# EAGLE design Converter (EAGLE 9.1.3)

## Sheet 1 of 3: Connectors & Caps
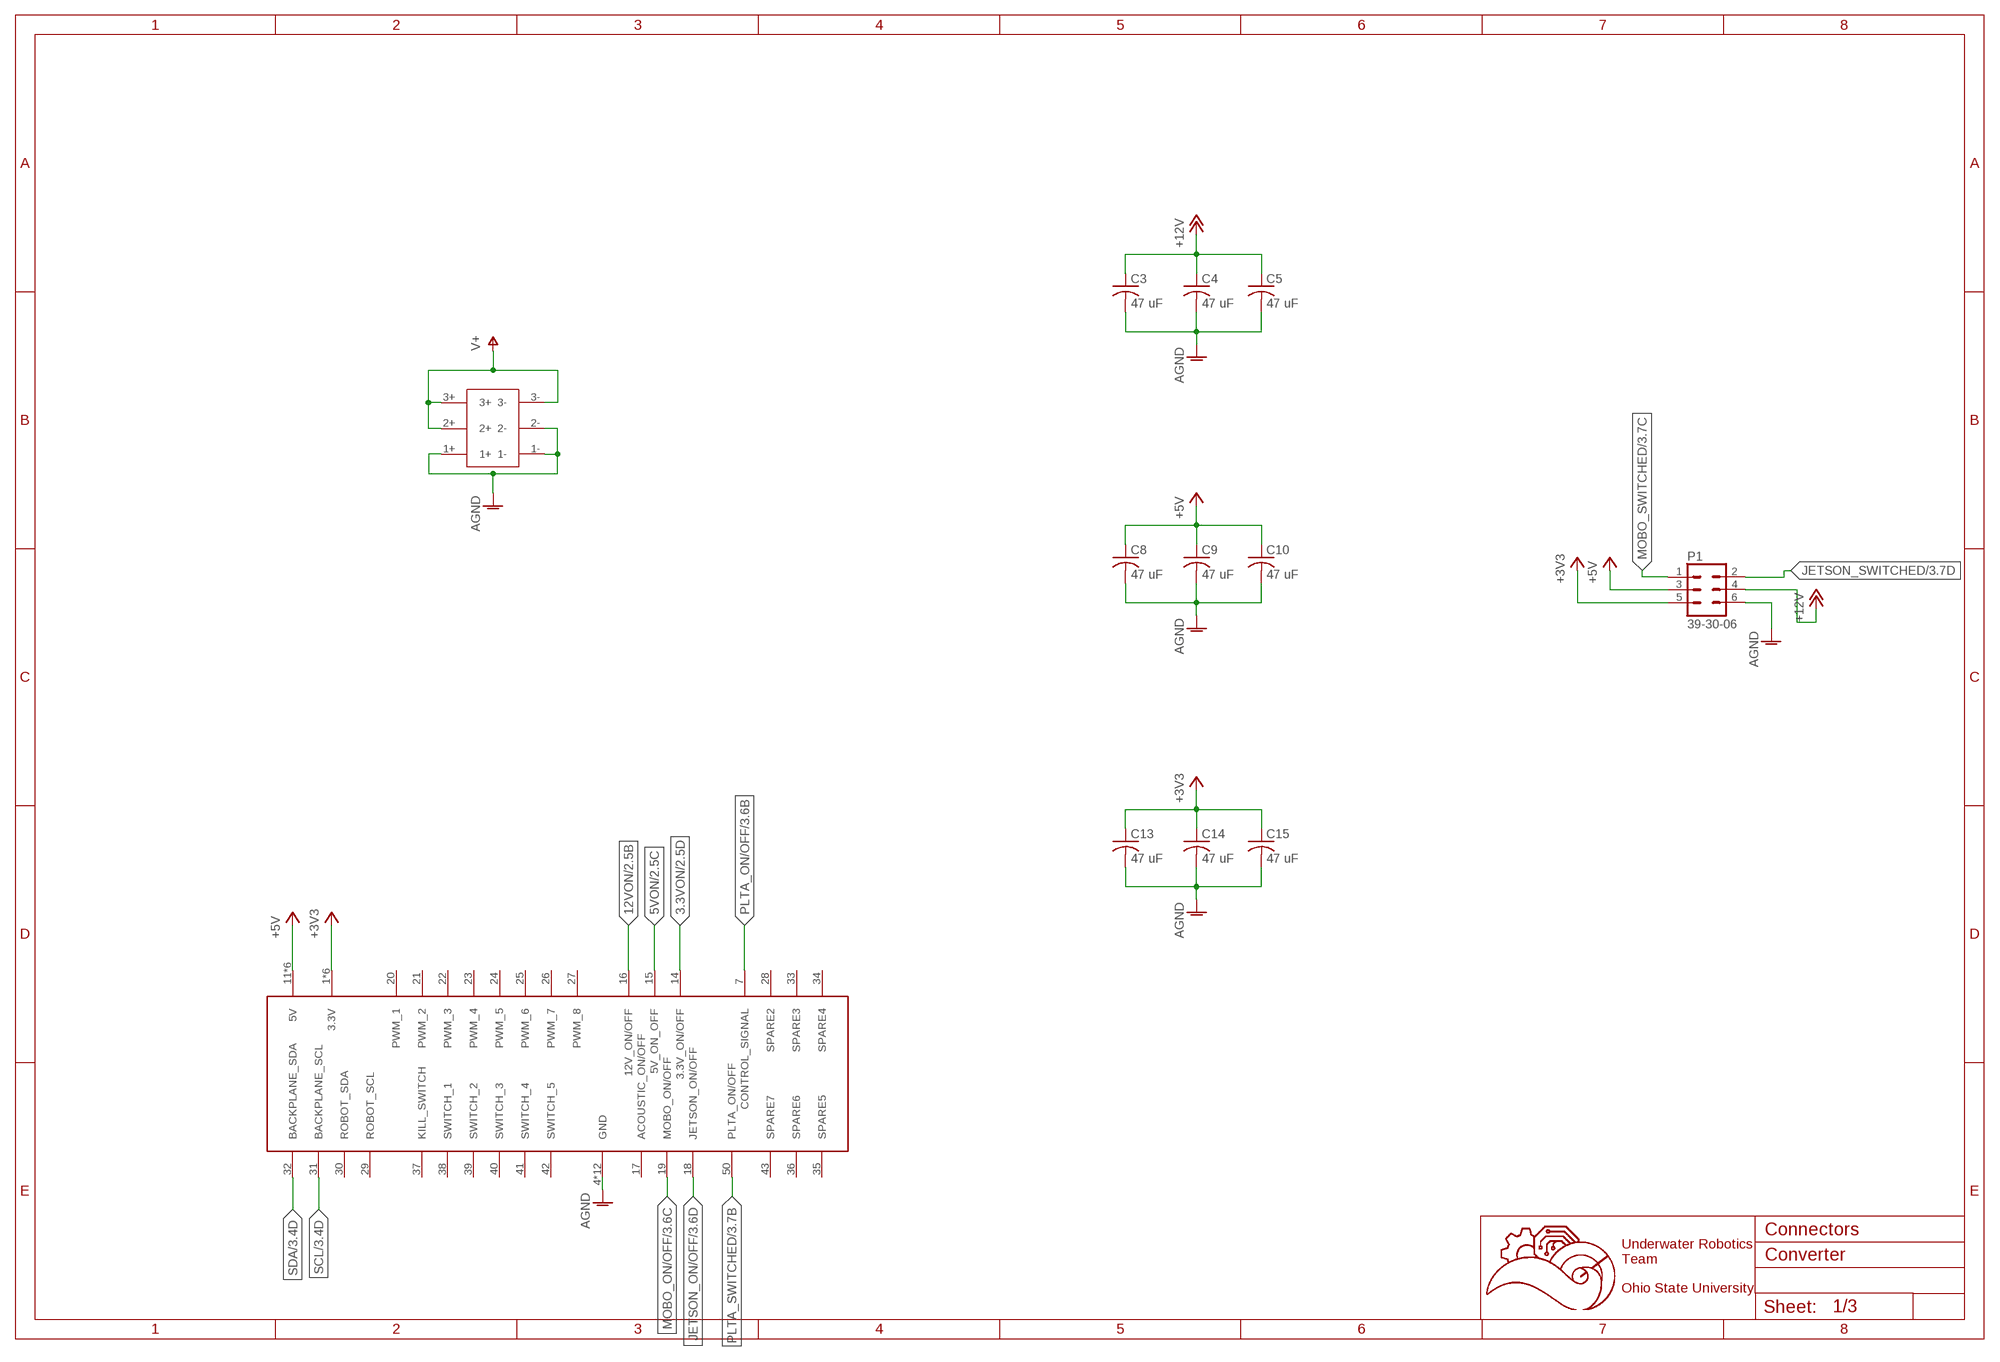
[diagram p0: schematic, sheet 1]

### Parts
C3  47 uF  C-USC1206K  [C1206K]
C4  47 uF  C-USC1206K  [C1206K]
C5  47 uF  C-USC1206K  [C1206K]
C8  47 uF  C-USC1206K  [C1206K]
C9  47 uF  C-USC1206K  [C1206K]
C10  47 uF  C-USC1206K  [C1206K]
C13  47 uF  C-USC1206K  [C1206K]
C14  47 uF  C-USC1206K  [C1206K]
C15  47 uF  C-USC1206K  [C1206K]
P1  39-30-06  [39-30-?06?]
U$1  5530843-EDGE  [5530843-6-BOARDFINGERS]
U$3  6PIN-VERT  [6PIN_VERT]

### Nets
3.3VON: U$1.14(3.3V_ON/OFF) ; also sheet 2
5VON: U$1.15(5V_ON_OFF) ; also sheet 2
12VON: U$1.16(12V_ON/OFF) ; also sheet 2
+3V3: C13.1 C14.1 C15.1 P1.5 U$1.1(3.3V) U$1.2(3.3V) U$1.3(3.3V) U$1.54(3.3V) U$1.55(3.3V) U$1.56(3.3V) ; also sheet 2,3
+5V: C8.1 C9.1 C10.1 P1.3 U$1.11(5V) U$1.12(5V) U$1.13(5V) U$1.44(5V) U$1.45(5V) U$1.46(5V) ; also sheet 2,3
+12V: C3.1 C4.1 C5.1 P1.4 ; also sheet 2,3
AGND: C3.2 C4.2 C5.2 C8.2 C9.2 C10.2 C13.2 C14.2 C15.2 P1.6 U$1.4(GND) U$1.5(GND) U$1.6(GND) U$1.8(GND) U$1.9(GND) U$1.10(GND) U$1.47(GND) U$1.48(GND) U$1.49(GND) U$1.51(GND) U$1.52(GND) U$1.53(GND) U$3.1+ U$3.1- U$3.2- ; also sheet 2,3
JETSON_ON/OFF: U$1.18(JETSON_ON/OFF) ; also sheet 3
JETSON_SWITCHED: P1.2 ; also sheet 3
MOBO_ON/OFF: U$1.19(MOBO_ON/OFF) ; also sheet 3
MOBO_SWITCHED: P1.1 ; also sheet 3
PLTA_ON/OFF: U$1.7(CONTROL_SIGNAL) ; also sheet 3
PLTA_SWITCHED: U$1.50(PLTA_ON/OFF) ; also sheet 3
SCL: U$1.31(BACKPLANE_SCL) ; also sheet 3
SDA: U$1.32(BACKPLANE_SDA) ; also sheet 3
V+: U$3.2+ U$3.3+ U$3.3- ; also sheet 2
Unconnected: U$1.17(ACOUSTIC_ON/OFF) U$1.20(PWM_1) U$1.21(PWM_2) U$1.22(PWM_3) U$1.23(PWM_4) U$1.24(PWM_5) U$1.25(PWM_6) U$1.26(PWM_7) U$1.27(PWM_8) U$1.28(SPARE2) U$1.29(ROBOT_SCL) U$1.30(ROBOT_SDA) U$1.33(SPARE3) U$1.34(SPARE4) U$1.35(SPARE5) U$1.36(SPARE6) U$1.37(KILL_SWITCH) U$1.38(SWITCH_1) U$1.39(SWITCH_2) U$1.40(SWITCH_3) U$1.41(SWITCH_4) U$1.42(SWITCH_5) U$1.43(SPARE7)

### Notes on the sheet
- Connectors
- Underwater Robotics
  Team
  
  Ohio State University

## Sheet 2 of 3: Converter
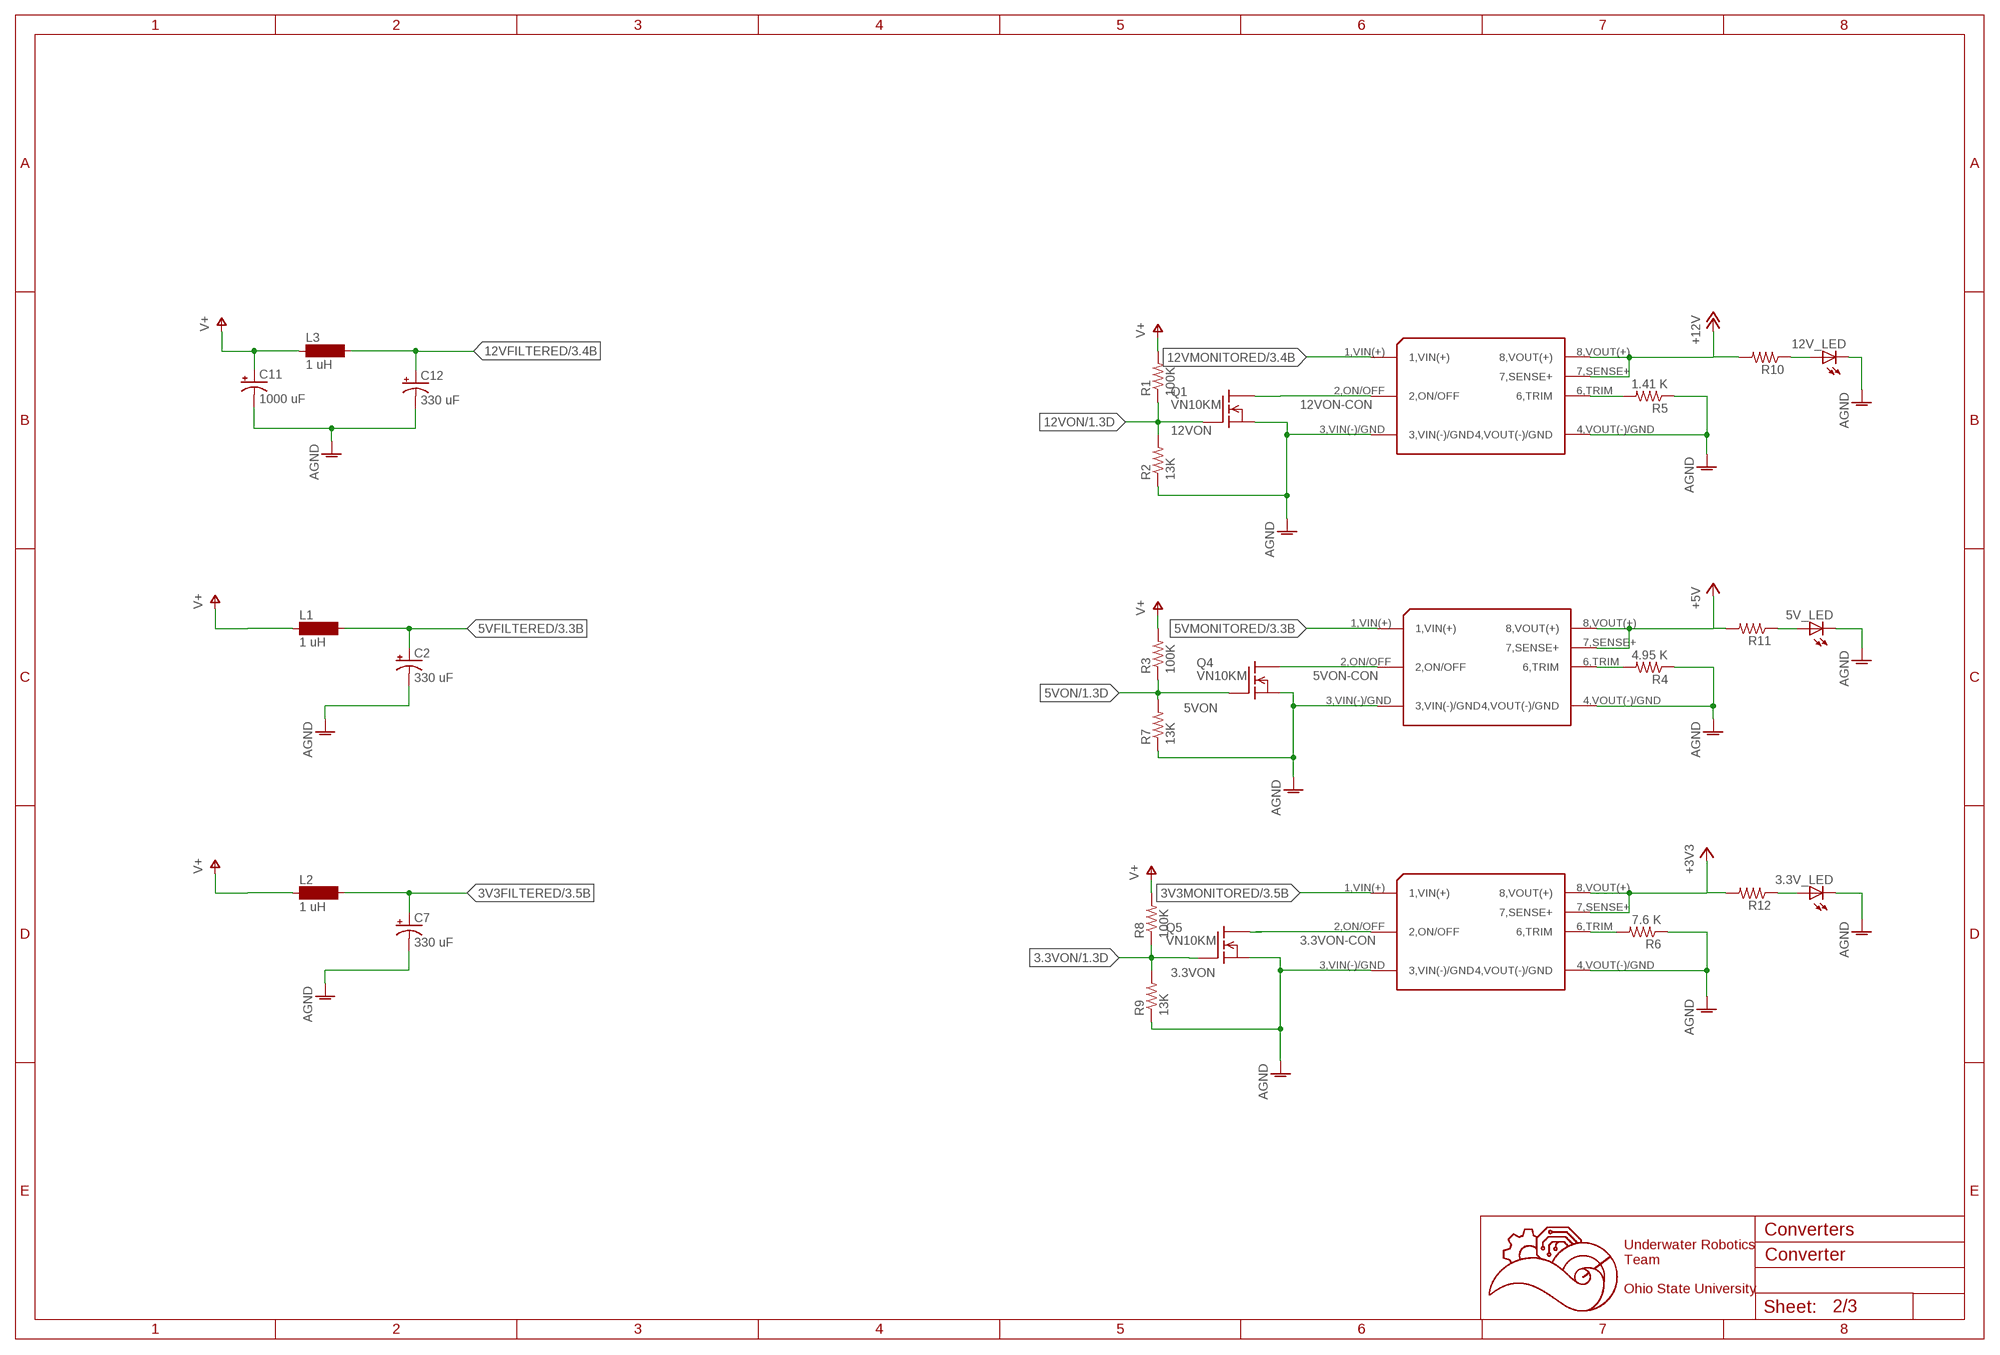
[diagram p1: schematic, sheet 2]

### Parts
3.3V_LED  LEDCHIPLED-0603-TTW  [CHIPLED-0603-TTW]
3.3VCONVERTER  CONVERTER  [CONVERTER]
5V_LED  LEDCHIPLED-0603-TTW  [CHIPLED-0603-TTW]
5VCONVERTER  CONVERTER  [CONVERTER]
12V_LED  LEDCHIPLED-0603-TTW  [CHIPLED-0603-TTW]
12VCONVERTER  CONVERTER  [CONVERTER]
C2  330 uF  CPOL-USE5-10.5  [E5-10,5]
C7  330 uF  CPOL-USE5-10.5  [E5-10,5]
C11  1000 uF  CPOL-USE5-13  [E5-13]
C12  330 uF  CPOL-USE5-10.5  [E5-10,5]
L1  1 uH  MS85  [MS85]
L2  1 uH  MS85  [MS85]
L3  1 uH  MS85  [MS85]
Q1  VN10KM  [TO237]
Q4  VN10KM  [TO237]
Q5  VN10KM  [TO237]
R1  100K  R-US_R0603  [R0603]
R2  13K  R-US_R0603  [R0603]
R3  100K  R-US_R0603  [R0603]
R4  4.95 K  R-US_R0603  [R0603]
R5  1.41 K  R-US_R0603  [R0603]
R6  7.6 K  R-US_R0603  [R0603]
R7  13K  R-US_R0603  [R0603]
R8  100K  R-US_R0603  [R0603]
R9  13K  R-US_R0603  [R0603]
R10  R-US_R0603  [R0603]
R11  R-US_R0603  [R0603]
R12  R-US_R0603  [R0603]

### Nets
3.3VON: Q5.2(G) R8.1 R9.2 ; also sheet 1
3.3VON-CON: 3.3VCONVERTER.2,ON/OFF Q5.1(D)
3V3FILTERED: C7.+ L2.2 ; also sheet 3
3V3MONITORED: 3.3VCONVERTER.1,VIN(+) ; also sheet 3
5VFILTERED: C2.+ L1.2 ; also sheet 3
5VMONITORED: 5VCONVERTER.1,VIN(+) ; also sheet 3
5VON: Q4.2(G) R3.1 R7.2 ; also sheet 1
5VON-CON: 5VCONVERTER.2,ON/OFF Q4.1(D)
12VFILTERED: C12.+ L3.2 ; also sheet 3
12VMONITORED: 12VCONVERTER.1,VIN(+) ; also sheet 3
12VON: Q1.2(G) R1.1 R2.2 ; also sheet 1
12VON-CON: 12VCONVERTER.2,ON/OFF Q1.1(D)
+3V3: 3.3VCONVERTER.7,SENSE+ 3.3VCONVERTER.8,VOUT(+) R12.2 ; also sheet 1,3
+5V: 5VCONVERTER.7,SENSE+ 5VCONVERTER.8,VOUT(+) R11.2 ; also sheet 1,3
+12V: 12VCONVERTER.7,SENSE+ 12VCONVERTER.8,VOUT(+) R10.2 ; also sheet 1,3
AGND: 3.3V_LED.C@1(C) 3.3VCONVERTER.3,VIN(-)/GND 3.3VCONVERTER.4,VOUT(-)/GND 5V_LED.C@1(C) 5VCONVERTER.3,VIN(-)/GND 5VCONVERTER.4,VOUT(-)/GND 12V_LED.C@1(C) 12VCONVERTER.3,VIN(-)/GND 12VCONVERTER.4,VOUT(-)/GND C2.- C7.- C11.- C12.- Q1.3(S) Q4.3(S) Q5.3(S) R2.1 R4.1 R5.1 R6.1 R7.1 R9.1 ; also sheet 1,3
N$1: 12VCONVERTER.6,TRIM R5.2
N$2: 5VCONVERTER.6,TRIM R4.2
N$3: 3.3VCONVERTER.6,TRIM R6.2
N$5: 12V_LED.A@1(A) R10.1
N$6: 5V_LED.A@1(A) R11.1
N$7: 3.3V_LED.A@1(A) R12.1
V+: C11.+ L1.1 L2.1 L3.1 R1.2 R3.2 R8.2 ; also sheet 1

### Notes on the sheet
- Converters
- Underwater Robotics
  Team
  
  Ohio State University
- C:/Users/blain/Downloads/Black and White.bmp

## Sheet 3 of 3
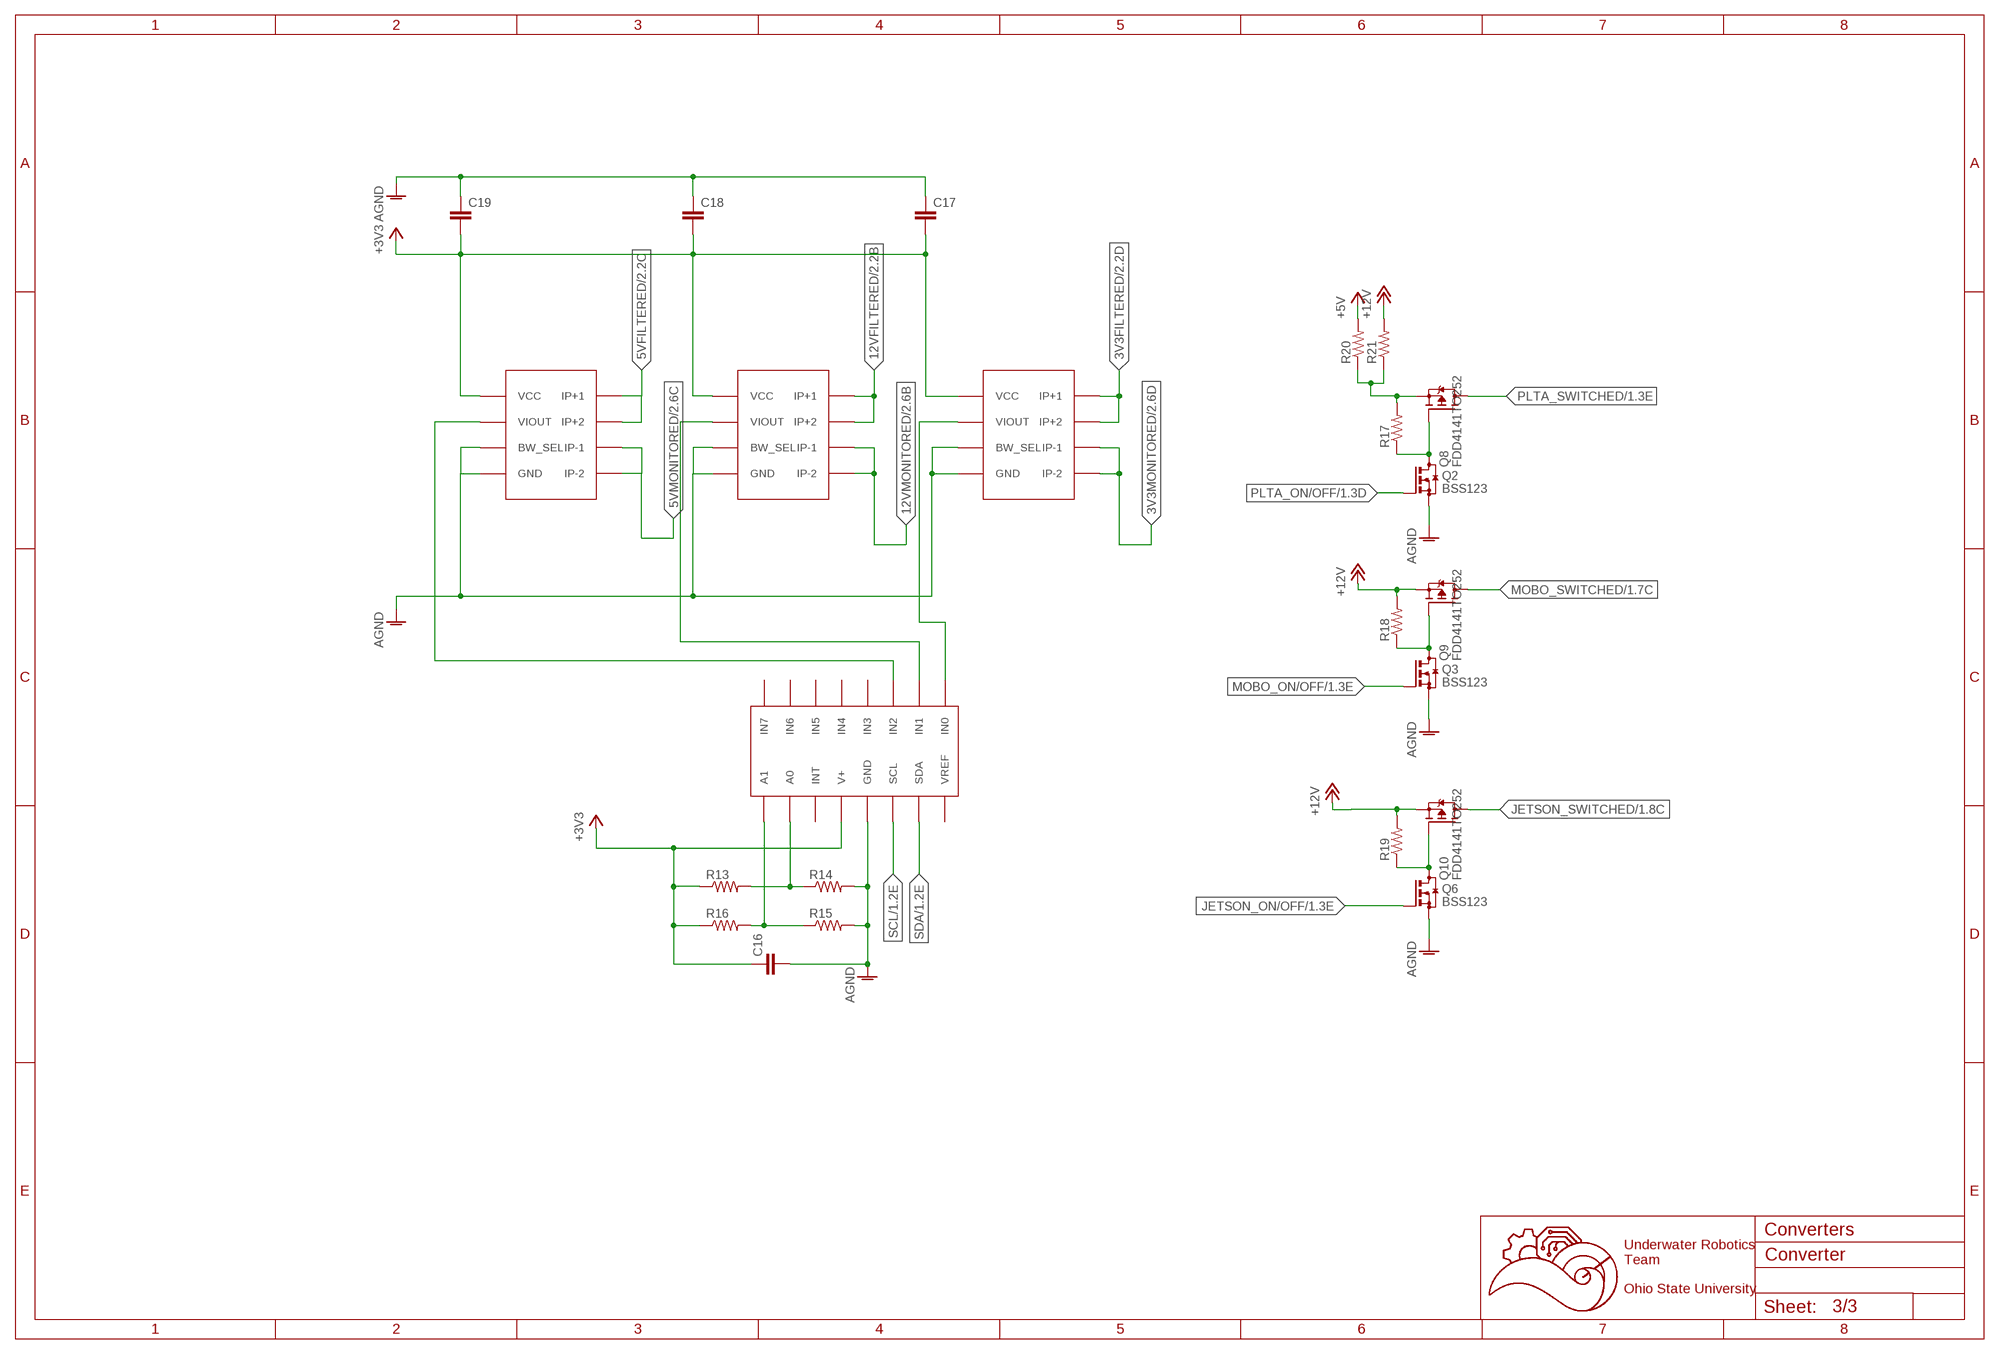
[diagram p2: schematic, sheet 3]

### Parts
1C  ACS722  [SOIC-8]
1C1  ACS722  [SOIC-8]
1C2  ACS722  [SOIC-8]
C16  C-EUC0603  [C0603]
C17  C-EUC0603  [C0603]
C18  C-EUC0603  [C0603]
C19  C-EUC0603  [C0603]
Q2  BSS123  [SOT23]
Q3  BSS123  [SOT23]
Q6  BSS123  [SOT23]
Q8  FDD4141TO252  [TO252]
Q9  FDD4141TO252  [TO252]
Q10  FDD4141TO252  [TO252]
R13  R-US_R0603  [R0603]
R14  R-US_R0603  [R0603]
R15  R-US_R0603  [R0603]
R16  R-US_R0603  [R0603]
R17  R-US_R0603  [R0603]
R18  R-US_R0603  [R0603]
R19  R-US_R0603  [R0603]
R20  R-US_R0603  [R0603]
R21  R-US_M2309  [M2309]
U$2  ADC128D818  [TSSOP-16]

### Nets
3V3FILTERED: 1C2.IP+1 1C2.IP+2 ; also sheet 2
3V3MONITORED: 1C2.IP-1 1C2.IP-2 ; also sheet 2
5VFILTERED: 1C.IP+1 1C.IP+2 ; also sheet 2
5VMONITORED: 1C.IP-1 1C.IP-2 ; also sheet 2
12VFILTERED: 1C1.IP+1 1C1.IP+2 ; also sheet 2
12VMONITORED: 1C1.IP-1 1C1.IP-2 ; also sheet 2
+3V3: 1C1.VCC 1C2.VCC 1C.VCC C16.1 C17.2 C18.2 C19.2 R13.1 R16.1 U$2.V+ ; also sheet 1,2
+5V: R20.2 ; also sheet 1,2
+12V: Q9.2(S) Q10.2(S) R18.2 R19.2 R21.2 ; also sheet 1,2
AGND: 1C1.BW_SEL 1C1.GND 1C2.BW_SEL 1C2.GND 1C.BW_SEL 1C.GND C16.2 C17.1 C18.1 C19.1 Q2.2(S) Q3.2(S) Q6.2(S) R14.2 R15.2 U$2.GND ; also sheet 1,2
JETSON_ON/OFF: Q6.1(G) ; also sheet 1
JETSON_SWITCHED: Q10.3(D) ; also sheet 1
MOBO_ON/OFF: Q3.1(G) ; also sheet 1
MOBO_SWITCHED: Q9.3(D) ; also sheet 1
N$8: Q2.3(D) Q8.1(G) R17.1
N$9: Q3.3(D) Q9.1(G) R18.1
N$10: Q8.2(S) R17.2 R20.1 R21.1
N$11: 1C.VIOUT U$2.IN2
N$12: 1C1.VIOUT U$2.IN1
N$13: 1C2.VIOUT U$2.IN0
N$14: Q6.3(D) Q10.1(G) R19.1
N$44: R13.2 R14.1 U$2.A0
N$46: R15.1 R16.2 U$2.A1
PLTA_ON/OFF: Q2.1(G) ; also sheet 1
PLTA_SWITCHED: Q8.3(D) ; also sheet 1
SCL: U$2.SCL ; also sheet 1
SDA: U$2.SDA ; also sheet 1
Unconnected: U$2.IN3 U$2.IN4 U$2.IN5 U$2.IN6 U$2.IN7 U$2.INT U$2.VREF

### Notes on the sheet
- Converters
- Underwater Robotics
  Team
  
  Ohio State University
- C:/Users/blain/Downloads/Black and White.bmp

## Library data of the parts
1C 1C1 1C2 = ACS722:ACS722
3.3V_LED 5V_LED 12V_LED = led:LED: LED OSRAM: - CHIPLED LG R971, LG N971, LY N971, LG Q971, LY Q971, LO R971, LY R971 LH N974, LH R974 LS Q976, LO Q976, LY Q976 LO Q996 - Hyper CHIPLED LW Q18S LB Q993, LB Q99A, LB R99A - SideLED LS A670, LO A670, LY A670, LG A670, LP A670 LB A673, LV A673, LT A673, LW A673 LH A674 LY A675 LS A676, LA A676, LO A676, LY A676, LW A676 LS A679, LY A679, LG A679 - Hyper Micro SIDELED® LS Y876, LA Y876, LO Y876, LY Y876 LT Y87S - SmartLED LW L88C, LW L88S LB L89C, LB L89S, LG L890 LS L89K, LO L89K, LY L89K LS L896, LA L896, LO L896, LY L896 - TOPLED LS T670, LO T670, LY T670, LG T670, LP T670 LSG T670, LSP T670, LSY T670, LOP T670, LYG T670 LG T671, LOG T671, LSG T671 LB T673, LV T673, LT T673, LW T673 LH T674 LS T676, LA T676, LO T676, LY T676, LB T676, LH T676, LSB T676, LW T676 LB T67C, LV T67C, LT T67C, LS T67K, LO T67K, LY T67K, LW E67C LS E67B, LA E67B, LO E67B, LY E67B, LB E67C, LV E67C, LT E67C LW T67C LS T679, LY T679, LG T679 LS T770, LO T770, LY T770, LG T770, LP T770 LB T773, LV T773, LT T773, LW T773 LH T774 LS E675, LA E675, LY E675, LS T675 LS T776, LA T776, LO T776, LY T776, LB T776 LHGB T686 LT T68C, LB T68C - Hyper Mini TOPLED® LB M676 - Mini TOPLED Santana® LG M470 LS M47K, LO M47K, LY M47K Source: http://www.osram.convergy.de LUXEON: - LUMILED® LXK2-PW12-R00, LXK2-PW12-S00, LXK2-PW14-U00, LXK2-PW14-V00 LXK2-PM12-R00, LXK2-PM12-S00, LXK2-PM14-U00 LXK2-PE12-Q00, LXK2-PE12-R00, LXK2-PE12-S00, LXK2-PE14-T00, LXK2-PE14-U00 LXK2-PB12-K00, LXK2-PB12-L00, LXK2-PB12-M00, LXK2-PB14-N00, LXK2-PB14-P00, LXK2-PB14-Q00 LXK2-PR12-L00, LXK2-PR12-M00, LXK2-PR14-Q00, LXK2-PR14-R00 LXK2-PD12-Q00, LXK2-PD12-R00, LXK2-PD12-S00 LXK2-PH12-R00, LXK2-PH12-S00 LXK2-PL12-P00, LXK2-PL12-Q00, LXK2-PL12-R00 Source: www.luxeon.com KINGBRIGHT: KA-3528ASYC Source: www.kingbright.com
3.3VCONVERTER 5VCONVERTER 12VCONVERTER = converter:CONVERTER
C2 C7 C11 C12 = rcl:CPOL-US: POLARIZED CAPACITOR, American symbol; SPICEPREFIX: C
C3-C5 C8-C10 C13-C15 = resistor:C-US: CAPACITOR, American symbol
C16-C19 = rcl:C-EU: CAPACITOR, European symbol; SPICEPREFIX: C
L1-L3 = inductor-neosid:MS85: INDUCTOR SMD power inductor; OC_FARNELL: unknown; OC_NEWARK: unknown
P1 = con-molex-mini-fit:39-30-?06?: HEADER
Q1 Q4 Q5 = transistor-fet:VN10KM: N-Channel Enhancement MOSFET (VMOS); 60V; 0,5A; 5,0Ohm
Q2 Q3 Q6 = transistor-small-signal:BSS123: N-CHANNEL MOS FET
Q8-Q10 = transistor-fet:FDD4141: P-Channel PowerTrench® MOSFET Source: FDD4141.pdf
R1-R12 = rcl:R-US_: RESISTOR, American symbol; SPICEPREFIX: R
R13-R21 = resistor:R-US_: RESISTOR, American symbol
U$1 = 5530843-6:5530843-EDGE
U$2 = ADC128D818:ADC128D818
U$3 = Vertical_Connectors:6PIN-VERT

## Board
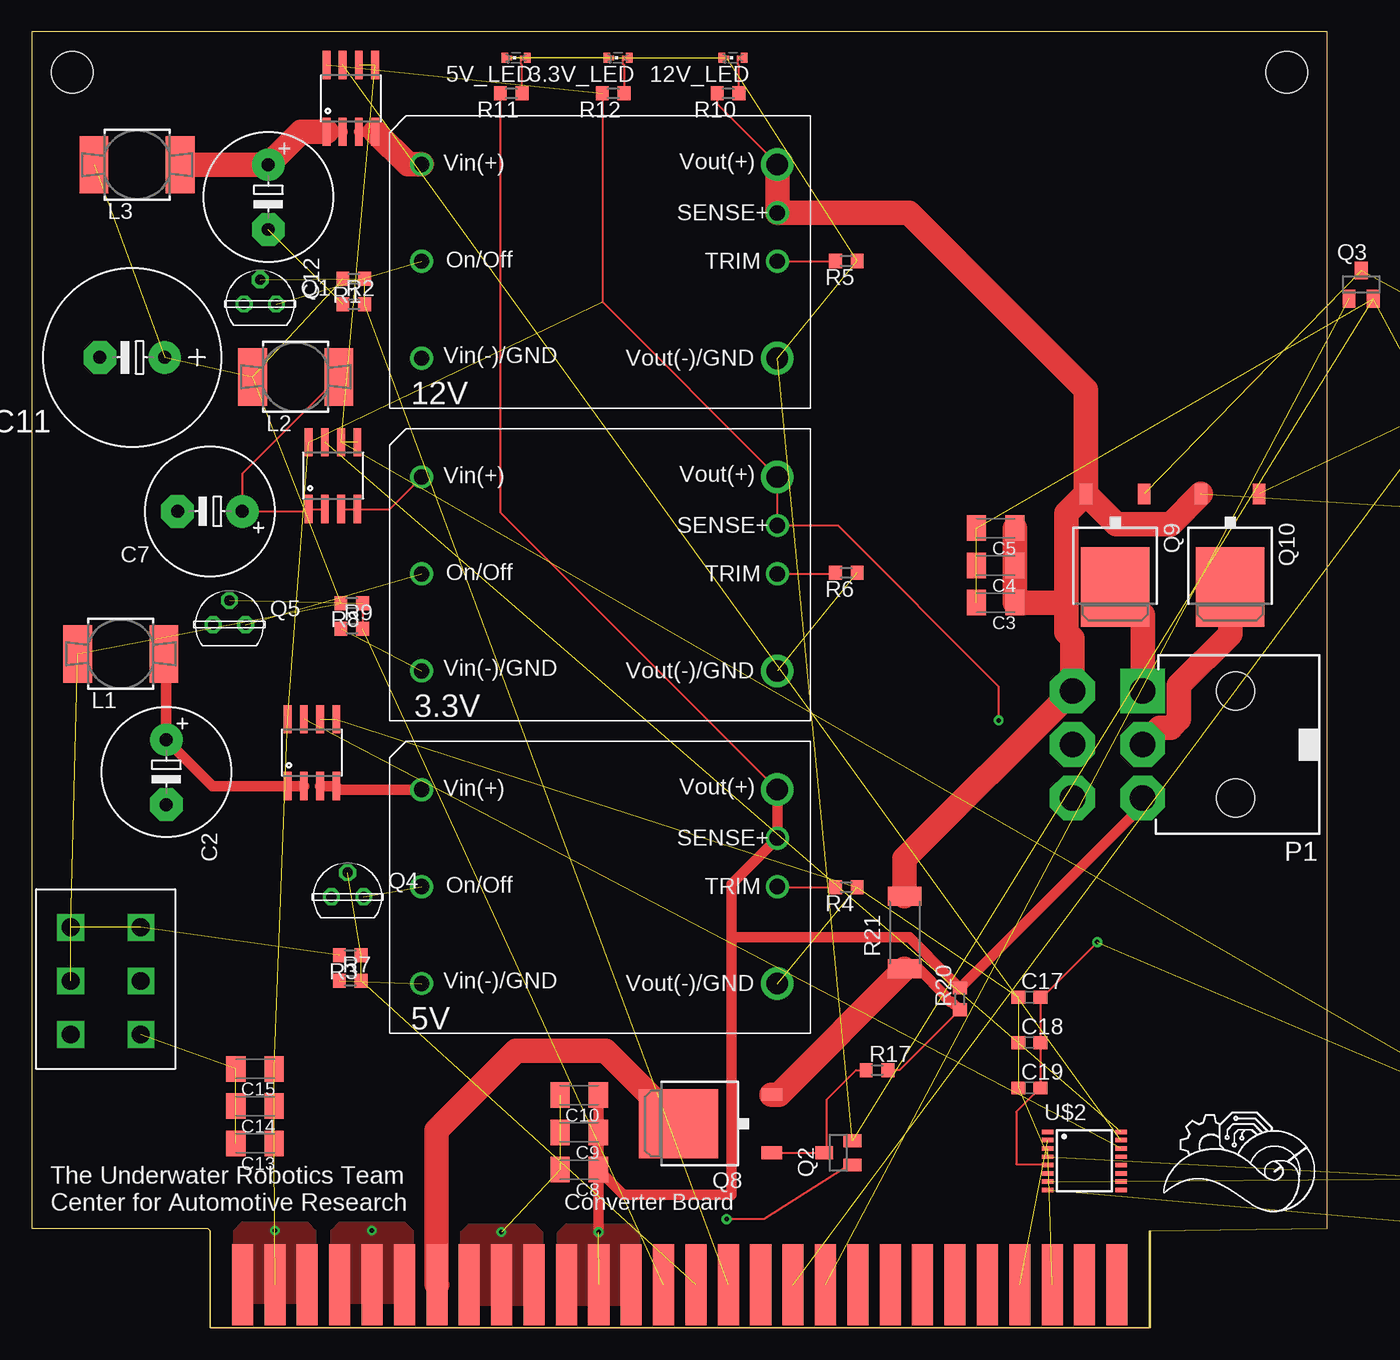
[diagram p3: board, top side]
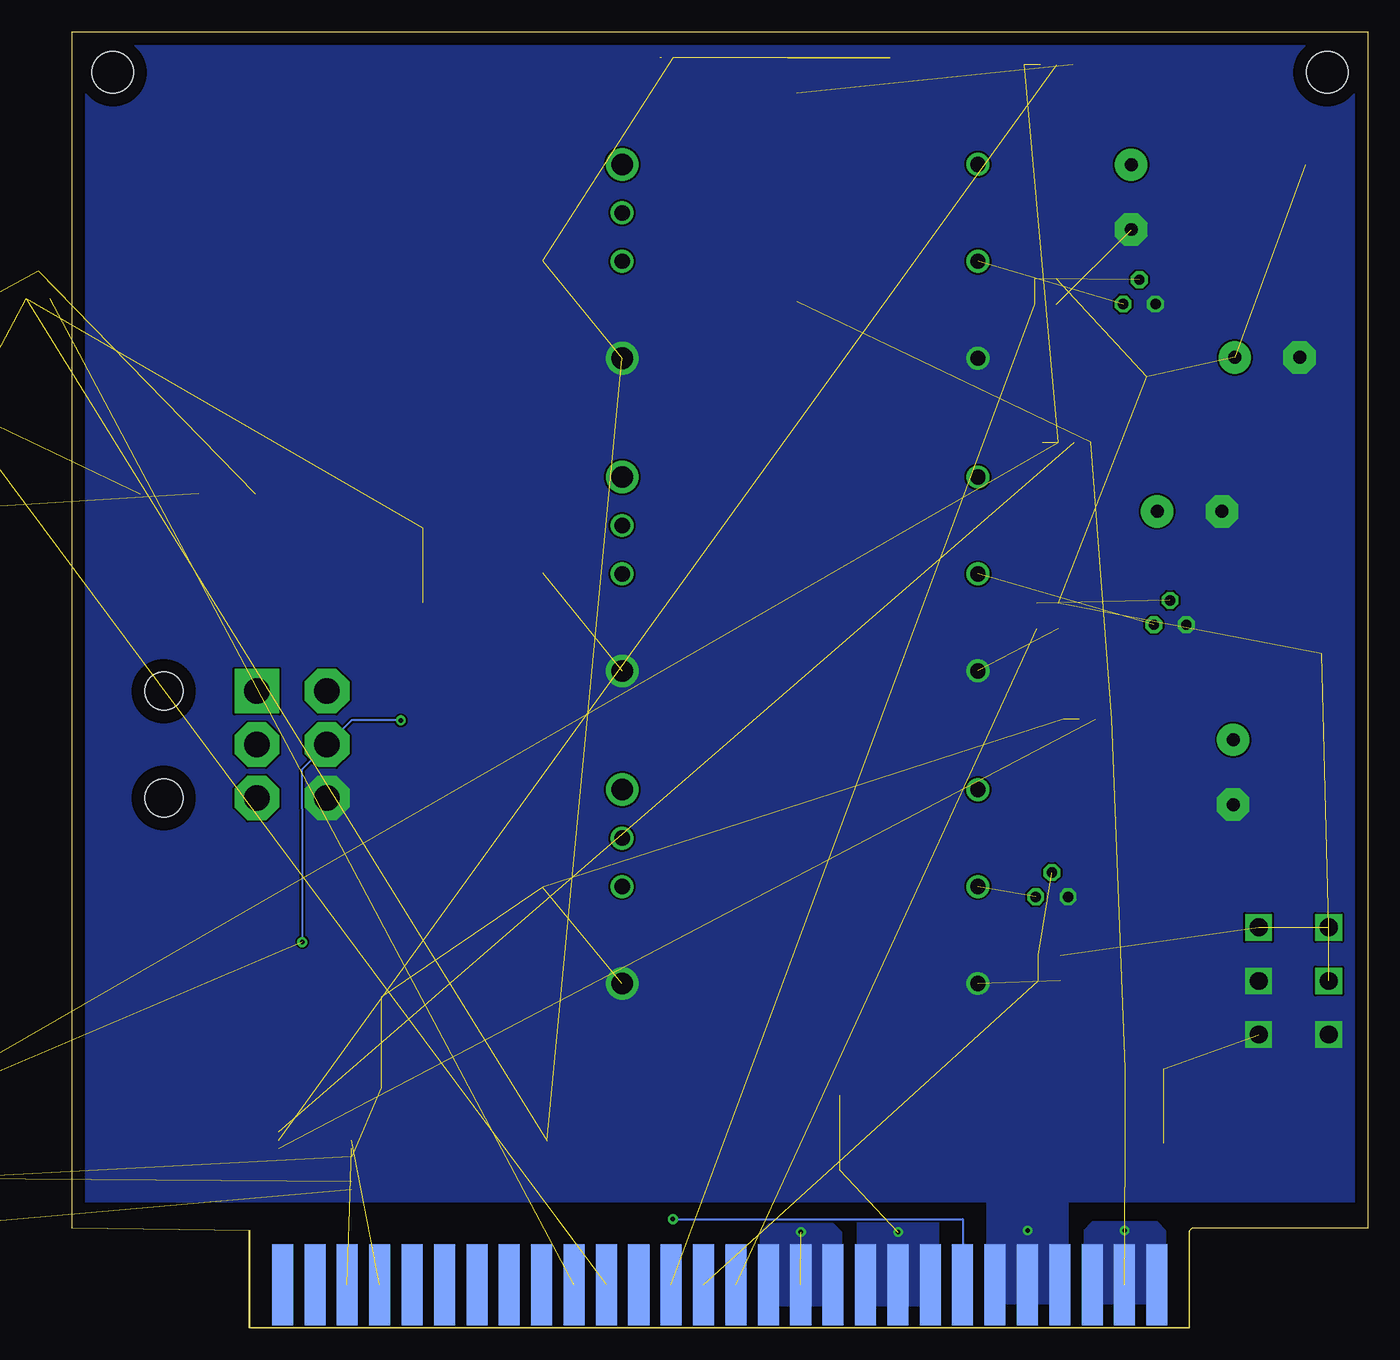
[diagram p4: board, bottom side, seen from below]

Size 101.6 x 101.6 mm. Coordinates in mm from the lower left corner, seen from the top.
Outline: 0,7.8 13.79,7.8 13.97,7.62 13.97,0 87.63,0 87.63,7.62 101.6,7.8 101.6,101.6 0,101.6 0,7.8
Copper layers (1*16): Top 0.035mm / dielectric 1.5mm / Bottom 0.035mm
Design rules "default": minimum track width 6mil, minimum drill 0.35mm, track to track 6mil, track to pad 6mil, pad to pad 6mil, via to via 6mil, smd to smd 6mil, copper to edge 40mil, drill to drill 6mil, minimum pad ring 10mil, minimum via ring 8mil, stop-mask expansion 4mil, vias tented up to drill 0mil, thermal gap 10mil
Holes 3.26 mm at 3.17,98.42 98.42,98.42

### Footprints (pad centres in the part's own frame; a part is rotated, then mirrored left to right if it is on the bottom)
SOIC-8 = smd 0.61 x 2.21: BW_SEL 0.635,2.616; GND 1.905,2.616; IP+1 -1.905,-2.616; IP+2 -0.635,-2.616; IP-1 0.635,-2.616; IP-2 1.905,-2.616; VCC -1.905,2.616; VIOUT -0.635,2.616
CHIPLED-0603-TTW = smd 0.8 x 0.5: A 0,-0.875; C 0,0.875 | smd 0.35 x 0.35: A@1 0,-0.5; C@1 0,0.5
CONVERTER = drill 1.2: 1,VIN(+) 2.5,19.1; 2,ON/OFF 2.5,11.5; 3,VIN(-)/GND 2.5,3.9; 6,TRIM 30.4,11.5; 7,SENSE+ 30.4,15.3 | drill 1.7: 4,VOUT(-)/GND 30.4,3.9; 8,VOUT(+) 30.4,19.1
E5-10,5 = drill 1.016 pad 2.54: + -2.54,0 | drill 1.016 pad 2.54 octagon: - 2.54,0
C1206K = smd 1.5 x 2: 1 -1.5,0; 2 1.5,0
E5-13 = drill 1.016 pad 2.54: + -2.54,0 | drill 1.016 pad 2.54 octagon: - 2.54,0
C0603 = smd 1.1 x 1: 1 -0.85,0; 2 0.85,0
MS85 = smd 4.5 x 2.25: 1 0,-3.383; 2 0,3.383
39-30-?06? = drill 2 pad 3.5 square: 1 4.191,0 | drill 2 pad 3.5 octagon: 2 0,0; 3 -4.191,0; 4 4.191,5.512; 5 0,5.512; 6 -4.191,5.512 | hole 3: -4.191,-7.3; 4.191,-7.3
TO237 = drill 0.813 octagon: 1 1.27,0; 2 0,1.905; 3 -1.27,0
SOT23 = smd 1 x 1.4: 1 -0.95,-1.1; 2 0.95,-1.1; 3 0,1.1
TO252 = smd 1 x 1.6: 1 -2.28,-4.8; 2 2.28,-4.8 | smd 5.4 x 6.2: 3 0,2.5
R0603 = smd 1 x 1.1: 1 -0.85,0; 2 0.85,0
M2309 = smd 1.5 x 2.6: 1 -2.85,0; 2 2.85,0
5530843-6-BOARDFINGERS = smd 1.651 x 6.35 bottom: 1 0.826,3.375; 2 3.365,3.375; 3 5.905,3.375; 4 8.445,3.375; 5 10.986,3.375; 6 13.525,3.375; 7 16.066,3.375; 8 18.605,3.375; 9 21.145,3.375; 10 23.686,3.375; 11 26.226,3.375; 12 28.765,3.375; 13 31.305,3.375; 14 33.846,3.375; 15 36.386,3.375; 16 38.925,3.375; 17 41.465,3.375; 18 44.005,3.375; 19 46.545,3.375; 20 49.086,3.375; 21 51.626,3.375; 22 54.166,3.375; 23 56.706,3.375; 24 59.245,3.375; 25 61.785,3.375; 26 64.326,3.375; 27 66.865,3.375; 28 69.406,3.375 | smd 1.651 x 6.35: 29 69.406,3.375; 30 66.865,3.375; 31 64.326,3.375; 32 61.785,3.375; 33 59.245,3.375; 34 56.706,3.375; 35 54.166,3.375; 36 51.626,3.375; 37 49.086,3.375; 38 46.545,3.375; 39 44.005,3.375; 40 41.465,3.375; 41 38.925,3.375; 42 36.386,3.375; 43 33.846,3.375; 44 31.305,3.375; 45 28.765,3.375; 46 26.226,3.375; 47 23.686,3.375; 48 21.145,3.375; 49 18.605,3.375; 50 16.066,3.375; 51 13.525,3.375; 52 10.986,3.375; 53 8.445,3.375; 54 5.905,3.375; 55 3.365,3.375; 56 0.826,3.375
TSSOP-16 = smd 0.9 x 0.35: A0 -2.875,-1.625; A1 -2.875,-2.275; GND -2.875,0.325; IN0 2.875,2.275; IN1 2.875,1.625; IN2 2.875,0.975; IN3 2.875,0.325; IN4 2.875,-0.325; IN5 2.875,-0.975; IN6 2.875,-1.625; IN7 2.875,-2.275; INT -2.875,-0.975; SCL -2.875,0.975; SDA -2.875,1.625; V+ -2.875,-0.325; VREF -2.875,2.275
6PIN_VERT = drill 1.4 square: 1+ 0,0; 1- 5.5,0; 2+ 0,4.2; 2- 5.5,4.2; 3+ 0,8.4; 3- 5.5,8.4

### Placement (x,y rotation side)
1C  21.97,45.09 0 top
1C1  25.02,96.39 0 top
1C2  23.62,66.8 0 top
3.3V_LED  45.97,99.57 90 top
3.3VCONVERTER  28.07,47.6 0 top
5V_LED  37.97,99.57 90 top
5VCONVERTER  28.07,23.09 0 top
12V_LED  54.99,99.57 90 top
12VCONVERTER  28.07,72.11 0 top
C2  10.54,43.56 270 top
C3  75.59,56.85 180 top
C4  75.59,59.77 180 top
C5  75.59,62.69 180 top
C7  13.97,64.01 180 top
C8  42.93,12.4 180 top
C9  42.93,15.32 180 top
C10  42.93,18.24 180 top
C11  7.87,76.07 180 top
C12  18.54,88.65 270 top
C13  17.5,14.45 180 top
C14  17.5,17.37 180 top
C15  17.5,20.29 180 top
C16  111.25,18.8 0 top  (outside the outline)
C17  78.23,25.91 0 top
C18  78.23,22.35 0 top
C19  78.23,18.8 0 top
L1  6.99,52.83 270 top
L2  20.7,74.55 270 top
L3  8.26,91.19 270 top
P1  39-30-06?  [39-30-?06?]  87.12,45.72 90 top
Q1  17.91,80.26 0 top
Q2  63.25,13.72 90 top
Q3  104.27,81.79 0 top
Q4  24.77,33.78 0 top
Q5  15.49,55.12 0 top
Q6  110.11,70.87 0 top  (outside the outline)
Q8  53.21,16 90 top
Q9  84.96,60.58 180 top
Q10  93.98,60.58 180 top
R1  25.25,82.25 180 top
R2  25.25,80.24 0 top
R3  24.97,29.21 180 top
R4  63.88,34.54 180 top
R5  63.88,83.64 180 top
R6  63.88,59.18 180 top
R7  24.97,27.2 0 top
R8  25.1,56.82 180 top
R9  25.1,54.81 0 top
R10  54.61,96.77 180 top
R11  37.59,96.77 180 top
R12  45.59,96.77 180 top
R13  111.25,15.24 0 top  (outside the outline)
R14  111.25,11.68 0 top  (outside the outline)
R15  111.25,8.13 0 top  (outside the outline)
R16  111.25,4.57 0 top  (outside the outline)
R17  66.29,20.19 0 top
R18  143.26,62.1 0 top  (outside the outline)
R19  152.27,62.1 0 top  (outside the outline)
R20  72.77,25.78 90 top
R21  68.45,30.99 90 top
U$1  15.7,0 0 top
U$2  82.55,13.08 0 top
U$3  3.05,22.99 0 top

### Tracks (layer width: path | path; a pad name or v marks a point on that pad's centre or on a via)
3.3VON  (2 unrouted)
  Top 0.152: R8.1 R9.2 25.95,54.79
  Bottom 0.152: 49.66,3.29 U$1.14
3.3VON-CON  (1 unrouted)
3V3FILTERED
  Top 0.152: L2.2 16.51,66.97 C7.+ 21.54,64.01 1C2.IP+1 1C2.IP+2
3V3MONITORED
  Top 0.152: 1C2.IP-1 1C2.IP-2 28.05,64.19 3.3VCONVERTER.1,VIN(+)
5VFILTERED
  Top 0.813: L1.2 10.54,52.66 C2.+ 14.17,42.47 1C.IP+1 1C.IP+2
5VMONITORED
  Top 0.813: 1C.IP-1 1C.IP-2 24.16,42.19 5VCONVERTER.1,VIN(+)
5VON  (3 unrouted)
  Top 0.152: 25.83,27.23 R7.2
5VON-CON  (1 unrouted)
12VFILTERED
  Top 0.813: 1C1.IP+2 1C1.IP+1
  Top 1.905: L3.2 C12.+ 21.13,93.78 1C1.IP+1
12VMONITORED
  Top 0.813: 1C1.IP-1 1C1.IP-2
  Top 1.905: 1C1.IP-2 29.49,91.21 12VCONVERTER.1,VIN(+)
12VON  (3 unrouted)
  Top 0.152: 26.11,82.25 R1.1 | R2.2
12VON-CON  (1 unrouted)
+3V3  (via drill 0.35)  (11 unrouted)
  Top 0.152: R12.2 44.74,80.42 3.3VCONVERTER.8,VOUT(+) 3.3VCONVERTER.7,SENSE+ 63.21,62.9 75.82,50.29 v75.82,47.62 | v83.57,30.23 79.25,25.91 C17.2 C18.2 C19.2 77.22,16.93 77.22,12.83 79.6,12.83 U$2.V+
  Bottom 0.152: v75.82,47.62 79.7,47.62 P1.5 83.59,43.74 83.59,40.71 83.57,40.69 v83.57,30.23
  other vias: 19.05,7.62
  pour Top (no thermals): 15.88,7.62 16.51,8.26 21.59,8.26 22.23,7.62 22.23,1.91 15.88,1.91
  pour Bottom (no thermals): 15.88,7.62 16.51,8.26 21.59,8.26 22.23,7.62 22.23,1.91 15.88,1.91
+5V  (via drill 0.35)  (1 unrouted)
  Top 0.152: 5VCONVERTER.8,VOUT(+) 36.74,63.91 R11.2
  Top 0.813: 5VCONVERTER.8,VOUT(+) 5VCONVERTER.7,SENSE+ 54.86,34.79 54.86,30.61 | 54.86,30.61 54.86,10.41 46.41,10.41 C8.1 | C10.1 C9.1 C8.1 | C8.1 44.43,7.52 v44.45,7.49 | 54.86,30.61 68.82,30.61 70.31,29.12 70.31,29.09 R20.2 87.12,40.98 P1.3
  pour Bottom (no thermals): 41.27,7.49 41.91,8.13 46.99,8.13 47.62,7.49 47.62,1.78 41.27,1.78
  pour Top (no thermals): 41.27,7.49 41.91,8.13 46.99,8.13 47.62,7.49 47.62,1.78 41.27,1.78
+12V  (2 unrouted)
  Top 0.152: 12VCONVERTER.8,VOUT(+) 53.76,95.92 R10.2
  Top 1.905: 81.16,57.15 81.16,54.52 81.61,54.07 P1.4 68.45,36.75 R21.2 | 81.16,57.15 81.16,63.85 Q9.2 | Q9.2 85.07,62.99 89.31,62.99 Q10.2 | 12VCONVERTER.8,VOUT(+) 12VCONVERTER.7,SENSE+ 68.8,87.41 82.68,73.53 Q9.2 | 81.16,57.15 80.85,56.84 C3.1 C4.1 C5.1
AGND  (via drill 0.35)  (34 unrouted)
  other vias: 26.67,7.62 36.83,7.49
  pour Bottom (no thermals): 102.87,103.35 102.87,9.91 -1.02,9.91 -1.02,102.62 -1.02,102.87 0,102.87
  pour Bottom: 23.5,7.62 23.5,10.54 29.84,10.54 29.84,7.24 23.5,7.24
  pour Bottom (no thermals): 23.5,7.62 24.13,8.26 29.21,8.26 29.84,7.62 29.84,1.91 23.5,1.91
  pour Top (no thermals): 23.5,7.62 24.13,8.26 29.21,8.26 29.84,7.62 29.84,1.91 23.5,1.91
  pour Bottom: 33.66,7.49 33.66,10.41 40.01,10.41 40.01,7.11 33.66,7.11
  pour Bottom (no thermals): 33.66,7.49 34.29,8.13 39.37,8.13 40.01,7.49 40.01,1.78 33.66,1.78
  pour Top (no thermals): 33.66,7.49 34.29,8.13 39.37,8.13 40.01,7.49 40.01,1.78 33.66,1.78
JETSON_ON/OFF  (1 unrouted)
JETSON_SWITCHED
  Top 1.905: P1.2 88.46,47.06 89.33,47.06 89.98,47.7 89.98,50.37 93.98,54.37 Q10.3
MOBO_ON/OFF  (1 unrouted)
MOBO_SWITCHED
  Top 1.905: Q9.3 87.12,55.92 P1.1
N$1
  Top 0.152: R5.2 63,83.61 12VCONVERTER.6,TRIM
N$2
  Top 0.152: 5VCONVERTER.6,TRIM 58.51,34.54 R4.2
N$3
  Top 0.152: 63.37,59.23 63.1,59.19 | 63.1,59.19 R6.2 | 3.3VCONVERTER.6,TRIM 63.01,59.1 63.1,59.19
N$5  (1 unrouted)
  Top 0.152: 55.39,99.57 55.39,99.07 55.46,99 R10.1
N$6  (1 unrouted)
  Top 0.152: 38.37,99.57 38.37,99.07 38.44,99 R11.1
N$7  (1 unrouted)
  Top 0.152: R12.1 46.47,96.81 46.47,98.97 46.37,99.07 46.37,99.57
N$8
  Top 0.152: Q8.1 Q2.3 62.36,13.93 62.36,17.91 64.64,20.19 R17.1
N$9  (2 unrouted)
N$10
  Top 0.152: R20.1 68.03,20.19 R17.2
  Top 0.813: R21.1 69.56,28.14 71.66,26.04 71.66,25.9 71.99,25.57 72.13,25.57 R20.1
  Top 1.905: R21.1 58.6,18.28 Q8.2
N$11  (1 unrouted)
N$12  (1 unrouted)
N$13  (1 unrouted)
N$14  (2 unrouted)
N$44  (2 unrouted)
N$46  (2 unrouted)
PLTA_ON/OFF  (via drill 0.35)
  Top 0.152: v54.48,8.51 57.4,8.51 64.14,12.77 Q2.1
  Bottom 0.152: v54.48,8.51 31.75,8.51 U$1.7
PLTA_SWITCHED
  Top 1.905: U$1.50 31.75,3.39 31.75,15.49 37.97,21.72 45,21.72 Q8.3
SCL  (1 unrouted)
SDA  (1 unrouted)
V+  (9 unrouted)

### Text on the board
tPlace: 12V | 3.3V | 5V | The Underwater Robotics Team / Center for Automotive Research | Converter Board